# EAGLE design RPI.v5_PCM5122brd (EAGLE 7.1.0)
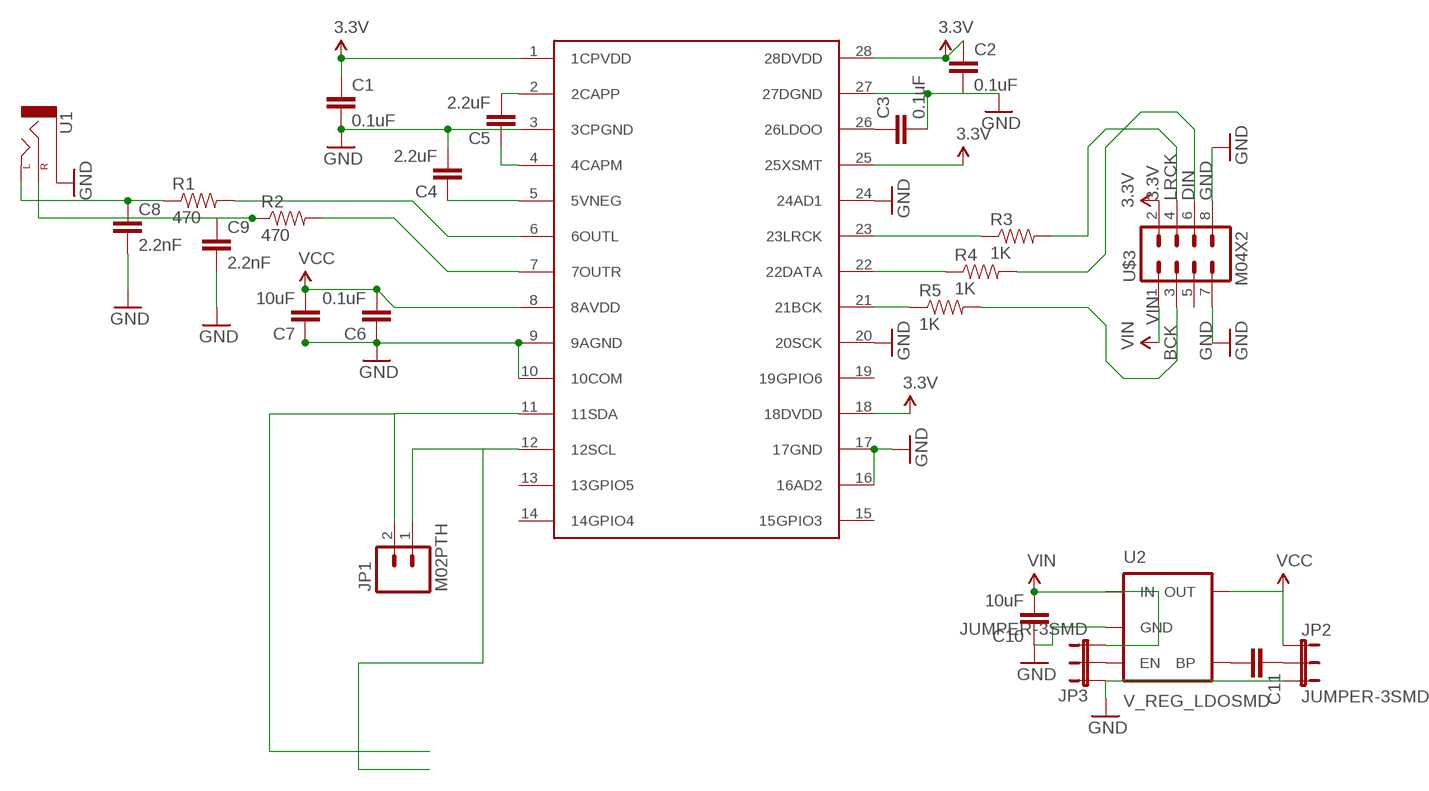
[diagram p0: schematic, sheet 1]

## Parts
C1  0.1uF  CAP0805  [0805]
C2  0.1uF  CAP0805  [0805]
C3  0.1uF  CAP0805  [0805]
C4  2.2uF  CAP0805  [0805]
C5  2.2uF  CAP0805  [0805]
C6  0.1uF  CAP0805  [0805]
C7  10uF  CAP0805  [0805]
C8  2.2nF  CAPPTH1  [CAP-PTH-5MM]
C9  2.2nF  CAPPTH1  [CAP-PTH-5MM]
C10  10uF  CAP0805  [0805]
C11  CAP0805  [0805]
JP1  M02PTH  [1X02]
JP2  JUMPER-3SMD  [SJ_3]
JP3  JUMPER-3SMD  [SJ_3]
R1  470  RESISTORPTH-1/4W  [AXIAL-0.4]
R2  470  RESISTORPTH-1/4W  [AXIAL-0.4]
R3  1K  RESISTOR0805-RES  [0805]
R4  1K  RESISTOR0805-RES  [0805]
R5  1K  RESISTOR0805-RES  [0805]
U1  AUDIO-JACKPTH  [AUDIO-JACK]
U2  V_REG_LDOSMD  [SOT23-5]
U$3  M04X2  [2X4]
U$5  PCM5122  [TSSOP28]

## Nets
3.3V: C1.1 C2.1 U$3.2 U$5.1(1CPVDD) U$5.18(18DVDD) U$5.25(25XSMT) U$5.28(28DVDD)
BCK: R5.2 U$3.3
DIN: R4.2 U$3.6
GND: C1.2 C2.2 C3.2 C4.2 C6.1 C7.1 C8.2 C9.2 C10.1 JP2.3 JP3.1 U1.SLEEVE U2.2(GND) U$3.7 U$3.8 U$5.3(3CPGND) U$5.9(9AGND) U$5.10(10COM) U$5.16(16AD2) U$5.17(17GND) U$5.20(20SCK) U$5.24(24AD1) U$5.27(27DGND)
LRCK: R3.2 U$3.4
N$1: C3.1 U$5.26(26LDOO)
N$2: C5.2 U$5.2(2CAPP)
N$3: C5.1 U$5.4(4CAPM)
N$4: C4.1 U$5.5(5VNEG)
N$5: C9.1 R2.P$1 U1.RING(RIGHT)
N$6: C8.1 R1.P$1 U1.TIP(LEFT)
N$7: R1.P$2 U$5.6(6OUTL)
N$8: R2.P$2 U$5.7(7OUTR)
N$9: R3.1 U$5.23(23LRCK)
N$10: R4.1 U$5.22(22DATA)
N$11: R5.1 U$5.21(21BCK)
N$12: JP1.2 U$5.11(11SDA)
N$13: JP1.1 U$5.12(12SCL)
N$15: C11.2 U2.4(BP)
N$16: C11.1 JP2.2
N$17: JP3.2 U2.3(EN)
VCC: C6.2 C7.2 JP2.1 U2.5(OUT) U$5.8(8AVDD)
VIN: C10.2 JP3.3 U2.1(IN) U$3.1
Unconnected: U$3.5 U$5.13(13GPIO5) U$5.14(14GPIO4) U$5.15(15GPIO3) U$5.19(19GPIO6)

## Library data of the parts
C1-C11 = SparkFun-Capacitors:CAP: Capacitor Standard 0603 ceramic capacitor, and 0.1" leaded capacitor.
JP1 = SparkFun-Connectors:M02: Standard 2-pin 0.1" header. Use with - straight break away headers ( PRT-00116) - right angle break away headers (PRT-00553) - swiss pins (PRT-00743) - machine pins (PRT-00117) - female headers (PRT-00115) Molex polarized connector foot print use with: PRT-08233 with associated crimp pins and housings. 2.54_SCREWTERM for use with PRT-10571. 3.5mm Screw Terminal footprints for PRT-08084 5mm Screw Terminal footprints for use with PRT-08433
JP2 JP3 = SparkFun-Passives:JUMPER-3
R1-R5 = SparkFun-Resistors:RESISTOR: Resistor Basic schematic elements and footprints for 0603, 1206, and PTH resistors.
U1 = SparkFun-Connectors:AUDIO-JACK: 3.5mm Audio Jack Simple 3.5mm common PCB mount audio jack. SKU: PRT-08032
U2 = SparkFun-PowerIC:V_REG_LDO: Voltage Regulator LDO Standard 150mA LDO voltage regulator in SOT-23 layout. Micrel part MIC5205. BP (by-pass) pin is used to lower output noise with 470pF cap.
U$3 = SparkFun-Connectors:M04X2: .1" header, two rows of four.
U$5 = ref-packages:PCM5122

## Net classes
0 default: width 0.254 mm

## Board
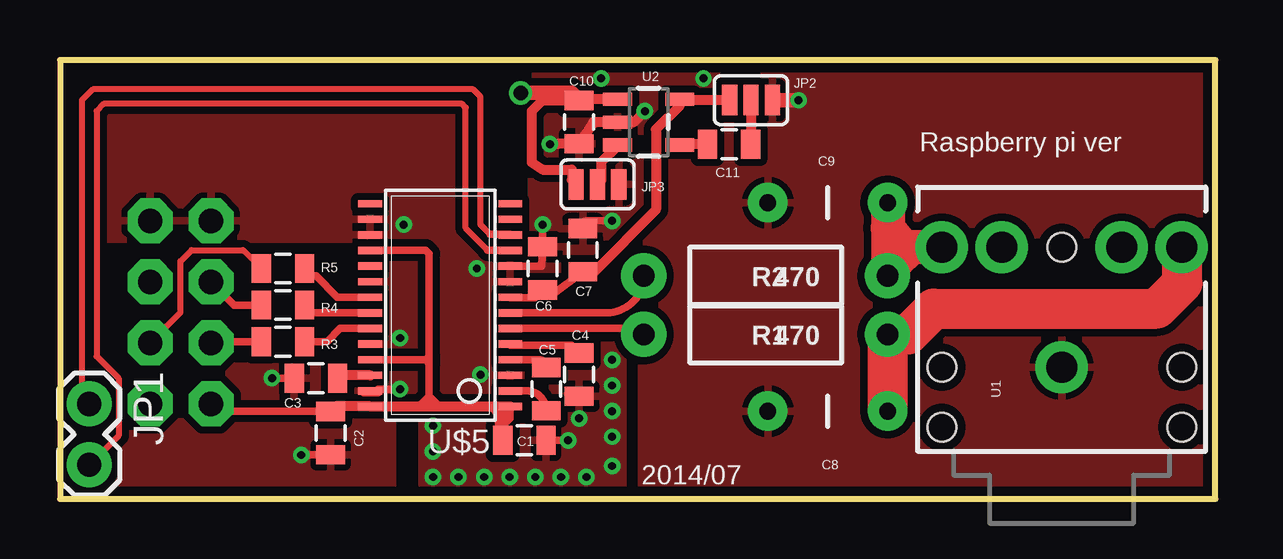
[diagram p1: board, top side]
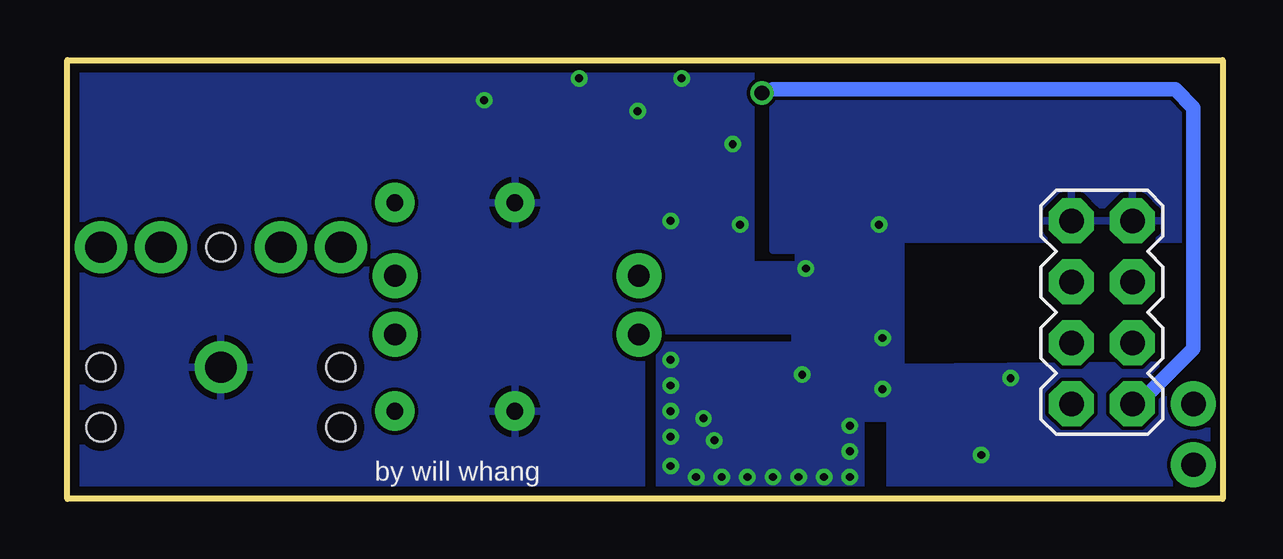
[diagram p2: board, bottom side, seen from below]

Size 48.16 x 18.29 mm. Coordinates in mm from the lower left corner, seen from the top.
Outline: 0,0 48.16,0 48.16,18.29 0,18.29 0,0
Copper layers (1*16): Top 0.0356mm / dielectric 1.5011mm / Bottom 0.0356mm
Design rules "LaenPCBOrder *": minimum track width 6mil, minimum drill 13mil, track to track 6mil, track to pad 6mil, pad to pad 6mil, via to via 6mil, smd to smd 6mil, copper to edge 15mil, drill to drill 6mil, minimum pad ring 7mil, minimum via ring 7mil, stop-mask expansion 3mil, vias tented up to drill 13mil, thermal gap 10mil

### Footprints (pad centres in the part's own frame; a part is rotated, then mirrored left to right if it is on the bottom)
0805 = smd 0.8 x 1.2: 1 -0.9,0; 2 0.9,0
CAP-PTH-5MM = drill 0.7 pad 1.651: 1 -2.5,0; 2 2.5,0
1X02 = drill 1.016 pad 1.88: 1 0,0; 2 2.54,0
SJ_3 = smd 0.635 x 1.27: 1 -0.889,0; 2 0,0; 3 0.889,0
AXIAL-0.4 = drill 0.9 pad 1.88: P$1 -5.08,0; P$2 5.08,0
AUDIO-JACK = drill 1.3 pad 2.184: RING 5,5; RSH 5,2.5; SLEEVE 0,0; TIP 5,-5; TSH 5,-2.5 | hole 1.2: 0,5; -2.5,5; -2.5,-5; 0,-5; 5,0
SOT23-5 = smd 0.55 x 1.2: 1 -0.95,-1.3; 2 0,-1.3; 3 0.95,-1.3; 4 0.95,1.3; 5 -0.95,1.3
2X4 = drill 1.016 pad 1.88 octagon: 1 -3.81,-1.27; 2 -3.81,1.27; 3 -1.27,-1.27; 4 -1.27,1.27; 5 1.27,-1.27; 6 1.27,1.27; 7 3.81,-1.27; 8 3.81,1.27
TSSOP28 = smd 0.305 x 0.991: 1 -4.225,-2.918; 2 -3.575,-2.918; 3 -2.925,-2.918; 4 -2.275,-2.918; 5 -1.625,-2.918; 6 -0.975,-2.918; 7 -0.325,-2.918; 8 0.325,-2.918; 9 0.975,-2.918; 10 1.625,-2.918; 11 2.275,-2.918; 12 2.925,-2.918; 13 3.575,-2.918; 14 4.225,-2.918; 15 4.225,2.918; 16 3.575,2.918; 17 2.925,2.918; 18 2.275,2.918; 19 1.625,2.918; 20 0.975,2.918; 21 0.325,2.918; 22 -0.325,2.918; 23 -0.975,2.918; 24 -1.625,2.918; 25 -2.275,2.918; 26 -2.925,2.918; 27 -3.575,2.918; 28 -4.225,2.918

### Placement (x,y rotation side)
C1  19.35,2.44 0 top
C2  11.28,2.74 270 top
C3  10.67,5.03 180 top
C4  21.64,5.18 270 top
C5  20.27,4.57 270 top
C6  20.12,9.6 270 top
C7  21.79,10.36 270 top
C8  32,3.66 180 top
C9  32,12.34 180 top
C10  21.64,15.7 90 top
C11  27.89,14.78 180 top
JP1  1.22,3.96 270 top
JP2  28.8,16.61 0 top
JP3  22.4,13.11 180 top
R1  29.41,6.86 180 top
R2  29.41,9.3 180 top
R3  9.3,6.55 180 top
R4  9.3,8.08 180 top
R5  9.3,9.6 180 top
U1  41.76,5.49 90 top
U2  24.54,15.7 270 top
U$3  5.03,7.77 90 bottom
U$5  15.85,8.08 90 top

### Tracks (layer width: path | path; a pad name or v marks a point on that pad's centre or on a via)
3.3V
  Top 0.305: 11.39,3.76 C2.1 6.62,3.64 U$3.2 | 18.47,2.45 C1.1 | U$5.28 14.98,3.85 15.39,4.27 | 15.7,3.96 15.39,4.27 | 15.39,4.27 15.39,5.64 | 15.39,5.64 15.24,5.79 12.94,5.79 U$5.25 15.25,5.8 15.39,5.94 | 15.39,5.94 15.39,5.64 | 15.39,5.94 15.39,10.21 15.24,10.36 U$5.18 | U$5.1 18.77,3.36 18.45,3.05 18.45,3.49 18.29,3.66 18.59,3.66 18.59,3.2 18.29,2.9 18.29,3.51 17.98,3.81
  Top 0.406: C2.1 11.49,3.85 U$5.28 U$5.1 | C1.1 18.45,3.05
BCK
  Top 0.254: U$3.3 5.03,7.77 5.03,9.91 5.49,10.36 7.63,10.36 R5.2
DIN
  Top 0.305: R4.2 7.26,8.08 U$3.6
GND  (via drill 0.33)
  Top 0.254: 12.95,4.42 U$5.27
  Top 0.305: v20.12,11.43 C6.1 20.08,9.7 U$5.10 | C7.1 21.35,11.26 | C2.2 10.07,1.84 v10.06,1.83 | C3.2 v8.84,5.03 | v21.18,2.44 C1.2 | v14.17,4.57 13.26,4.57 13.26,4.42 12.95,4.42 12.65,4.42 | U$5.10 | v23.01,11.58 21.95,11.58 arc90 21.79,11.43
  Top 0.406: v20.42,14.78 20.74,14.8 C10.1 22.24,15.7 U2.2 23.93,15.7 v24.38,16.15
  Top 0.61: v30.78,16.61 JP2.3
  other vias: 21.64,3.35 14.17,6.71 15.54,3.05 15.54,0.91 16.61,0.91 17.68,0.91 18.75,0.91 20.88,0.91 23.01,4.72 23.01,5.79 23.01,3.66 23.01,2.59 23.01,1.37 21.95,0.91 19.81,0.91 17.37,9.6 15.54,1.98 22.56,17.53 26.82,17.53 14.33,11.43 17.53,5.18
  pour Top (isolate 0.305): -1.52,19.66 18.75,19.66 18.75,10.36 17.68,10.36 17.68,9.75 19.66,9.75 19.66,19.66 49.23,19.66 49.23,-0.91 24.23,-0.91 24.23,7.01 17.83,7.01 17.83,6.4 23.47,6.4 23.47,-1.22 15.09,-1.22 15.09,3.35 13.87,3.35 13.87,-1.07 -2.13,-1.07 -2.13,5.64 13.41,5.49 13.41,10.82 -1.52,10.82
  pour Bottom: -1.52,19.66 18.75,19.66 18.75,10.36 17.68,10.36 17.68,9.75 19.66,9.75 19.66,19.66 49.53,19.66 49.53,-0.91 24.23,-0.91 24.23,7.01 17.83,7.01 17.83,6.4 23.47,6.4 23.47,-1.22 15.09,-1.22 15.09,3.35 13.87,3.35 13.87,-1.07 -2.13,-1.07 -2.13,5.64 13.41,5.49 13.41,10.82 -1.52,10.82
LRCK
  Top 0.305: R3.2 6.35,6.55 U$3.4
N$1
  Top 0.406: U$5.26 11.69,5.15 C3.1
N$2
  Top 0.305: U$5.2 19.44,4.5 arc-90 C5.2
N$3
  Top 0.305: U$5.4 19.94,5.8 arc-90 C5.1
N$4
  Top 0.305: C4.1 21.32,6.4 18.82,6.4 arc-90 U$5.5
N$5
  Top 1.422: C9.1 34.5,11.28 | 34.5,11.28 34.5,9.31 | U1.RING 35.48,10.49 | 35.48,10.49 34.75,9.75 | 35.48,10.49 34.59,10.36 35.27,10.36 34.5,11.28
  Top 1.676: 34.5,9.31 R2.P$1
N$6
  Top 1.676: C8.1 R1.P$1 35.36,6.86 36.42,7.92 45.72,7.92 46.79,8.99 46.79,10.46 U1.TIP
N$7
  Top 0.305: U$5.6 24.09,7.1 arc-90 R1.P$2
N$8
  Top 0.305: U$5.7 22.79,7.75 arc90 R2.P$2
N$9
  Top 0.305: U$5.23 11.67,7.1 11.13,6.55 R3.1
N$10
  Top 0.305: U$5.22 10.52,7.75 R4.1
  Top 0.406: 10.2,7.75 R4.1
N$11
  Top 0.305: U$5.21 11.56,8.4 10.67,9.3 10.5,9.3 R5.1
N$12
  Top 0.254: 17.83,10.36 16.92,11.28 16.92,16.31 16.76,16.46 1.83,16.46 1.52,16.15 1.52,5.94 2.44,5.03 2.44,2.64 JP1.2
  Top 0.305: 17.83,10.36 U$5.11 arc-90 U$5.11
N$13
  Top 0.254: 17.93,11.02 17.53,11.43 17.53,16.76 17.22,17.07 1.37,17.07 0.91,16.61 0.91,4.27 JP1.1
  Top 0.305: 17.93,11.02 18.75,11.02 arc-90 U$5.12
N$15
  Top 0.406: C11.2 25.87,14.78 U2.4
N$16
  Top 0.406: JP2.2 28.8,14.8 C11.1
N$17
  Top 0.406: U2.3 23.24,14.7 22.56,14.02 22.56,13.26 JP3.2
VCC
  Top 0.305: C7.2 20.57,8.55 C6.2 19.8,8.38 18.79,8.38 arc-90 U$5.8
  Top 0.406: C7.2 21.5,9.45 22.25,9.45 24.84,12.04 24.84,15.39 25.84,16.39 U2.5 25.87,16.61 JP2.1
VIN  (via drill 0.61)
  Top 0.406: U2.1 21.54,16.65 C10.2 20.1,16.6 19.66,16.15 19.66,14.02 20.12,13.72 21.34,13.72 21.34,13.28 JP3.3
  Top 0.61: v19.2,16.92 21.32,16.92 C10.2
  Bottom 0.61: U$3.1 3.51,3.96 1.22,6.25 1.22,16.31 1.98,17.07 18.75,17.07 v19.2,16.92

### Text on the board
tNames: Raspberry pi ver | 2014/07
bNames: by will whang